# Altium schematic sheet RELAY.SchDoc
size A4; SheetNumber: 10; SheetTotal: 10
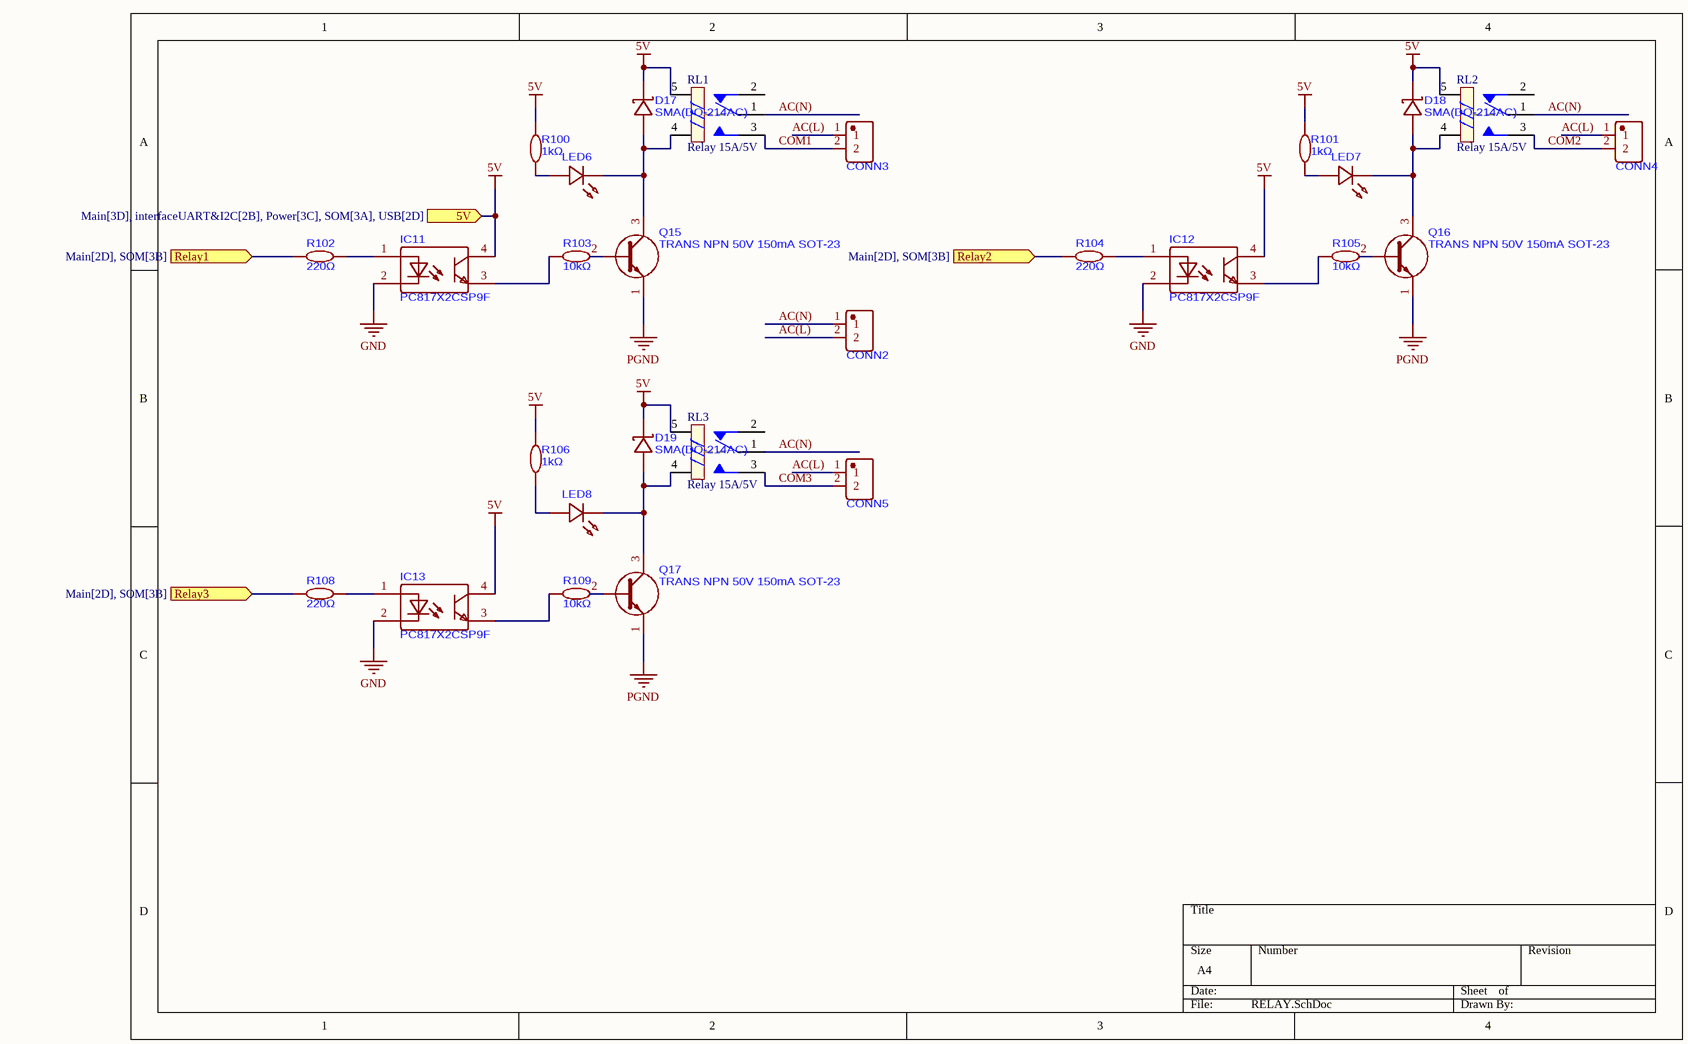
[diagram p0: RELAY.SchDoc]

## Parts
CONN2  TERM BLK 2POS 5mm TH  [CONN-TH_P5.00_KF128-5.0-2P]  (value not drawn)
CONN3  TERM BLK 2POS 5mm TH  [CONN-TH_P5.00_KF128-5.0-2P]  (value not drawn)
CONN4  TERM BLK 2POS 5mm TH  [CONN-TH_P5.00_KF128-5.0-2P]  (value not drawn)
CONN5  TERM BLK 2POS 5mm TH  [CONN-TH_P5.00_KF128-5.0-2P]  (value not drawn)
D17  SMA(DO-214AC)  [SMA_L4.4-W2.6-LS5.0-RD]
D18  SMA(DO-214AC)  [SMA_L4.4-W2.6-LS5.0-RD]
D19  SMA(DO-214AC)  [SMA_L4.4-W2.6-LS5.0-RD]
IC11  PC817X2CSP9F  [smd pc817]
IC12  PC817X2CSP9F  [smd pc817]
IC13  PC817X2CSP9F  [smd pc817]
LED6  XL-1608SURC-06  [LED0603-RD_RED]  (value not drawn)
LED7  XL-1608SURC-06  [LED0603-RD_RED]  (value not drawn)
LED8  XL-1608SURC-06  [LED0603-RD_RED]  (value not drawn)
Q15  TRANS NPN 50V 150mA SOT-23  [SOT-23-3_L2.9-W1.3-P1.90-LS2.4-BR]
Q16  TRANS NPN 50V 150mA SOT-23  [SOT-23-3_L2.9-W1.3-P1.90-LS2.4-BR]
Q17  TRANS NPN 50V 150mA SOT-23  [SOT-23-3_L2.9-W1.3-P1.90-LS2.4-BR]
R100  1kΩ  [R0603]
R101  1kΩ  [R0603]
R102  220Ω  [R0603]
R103  10kΩ  [R0603]
R104  220Ω  [R0603]
R105  10kΩ  [R0603]
R106  1kΩ  [R0603]
R108  220Ω  [R0603]
R109  10kΩ  [R0603]
RL1  Relay 15A/5V  [RL-5V-15A]
RL2  Relay 15A/5V  [RL-5V-15A]
RL3  Relay 15A/5V  [RL-5V-15A]

## Ports
5V (in, see Main[3D], interfaceUART&I2C[2B], Power[3C], SOM[3A], USB[2D]), Relay1 (in, see Main[2D], SOM[3B]), Relay2 (in, see Main[2D], SOM[3B]), Relay3 (in, see Main[2D], SOM[3B])

## Nets
5V: D17.1(K) D18.1(K) D19.1(K) IC11.4(COL) IC12.4(COL) IC13.4(COL) R100.2 R101.2 R106.2 RL1.5 RL2.5 RL3.5 ; port 5V
GND: IC11.2(CAT) IC12.2(CAT) IC13.2(CAT)
PGND: Q15.1 Q16.1 Q17.1
AC(L): CONN2.2 CONN3.1 CONN4.1 CONN5.1
AC(N): CONN2.1 RL1.1 RL2.1 RL3.1
COM1: CONN3.2 RL1.3
COM2: CONN4.2 RL2.3
COM3: CONN5.2 RL3.3
Relay1: R102.1 ; port Relay1
Relay2: R104.1 ; port Relay2
Relay3: R108.1 ; port Relay3
NetD17_2: D17.2(A) LED6.1(K) Q15.3 RL1.4
NetD18_2: D18.2(A) LED7.1(K) Q16.3 RL2.4
NetD19_2: D19.2(A) LED8.1(K) Q17.3 RL3.4
NetIC11_1: IC11.1(AN) R102.2
NetIC11_3: IC11.3(EM) R103.1
NetIC12_1: IC12.1(AN) R104.2
NetIC12_3: IC12.3(EM) R105.1
NetIC13_1: IC13.1(AN) R108.2
NetIC13_3: IC13.3(EM) R109.1
NetLED6_2: LED6.2(A) R100.1
NetLED7_2: LED7.2(A) R101.1
NetLED8_2: LED8.2(A) R106.1
NetQ15_2: Q15.2 R103.2
NetQ16_2: Q16.2 R105.2
NetQ17_2: Q17.2 R109.2

Not connected (* = marked no-connect by the designer): RL1 2; RL2 2; RL3 2

## Library data of the parts
CONN2-CONN5 = KF128-5.0-2P: 2.5 1x2P 12~22 Green 24A -40℃~+105℃ 250V Through Hole 5mm 1 2 Through Hole,P=5mm Wire to Board RoHS
D17-D19 = B340A-13-F: 80A 40V 500mV@3A 3A SMA(DO-214AC) Single Diodes ROHS
IC11-IC13 = PC817X2CSP9F: 50mA 200mV@20mA,1mA 80V 6V DC SMD-4P Transistor, Photovoltaic Output Optoisolators RoHS
LED6-LED8 = XL-1608SURC-06: 20mA 2.3V Red 50mW 0603 LED Indication - Discrete ROHS
Q15-Q17 = 2SC1815: 200mW 50V 150mA NPN SOT-23 Single Bipolar Transistors RoHS
R100 R101 R106 = RMC 0603 1K J N: 100mW 1kΩ 50V ±100ppm/℃ Thick Film Resistor ±5% 0603 Chip Resistor - Surface Mount ROHS
R102 R104 R108 = RC0603FR-07220RL: 100mW 220Ω 75V ±100ppm/℃ Thick Film Resistor ±1% 0603 Chip Resistor - Surface Mount RoHS
R103 R105 R109 = RC0603FR-0710KL: 100mW 10kΩ 75V ±100ppm/℃ Thick Film Resistor ±1% 0603 Chip Resistor - Surface Mount ROHS
RL1-RL3 = SRD-05VDC-SL-C: Relay SPDT,10A - 5VDC 5 Pin; Value: Relay SPDT, 10A, 12V